# Altium project science-board-25.PrjPcb
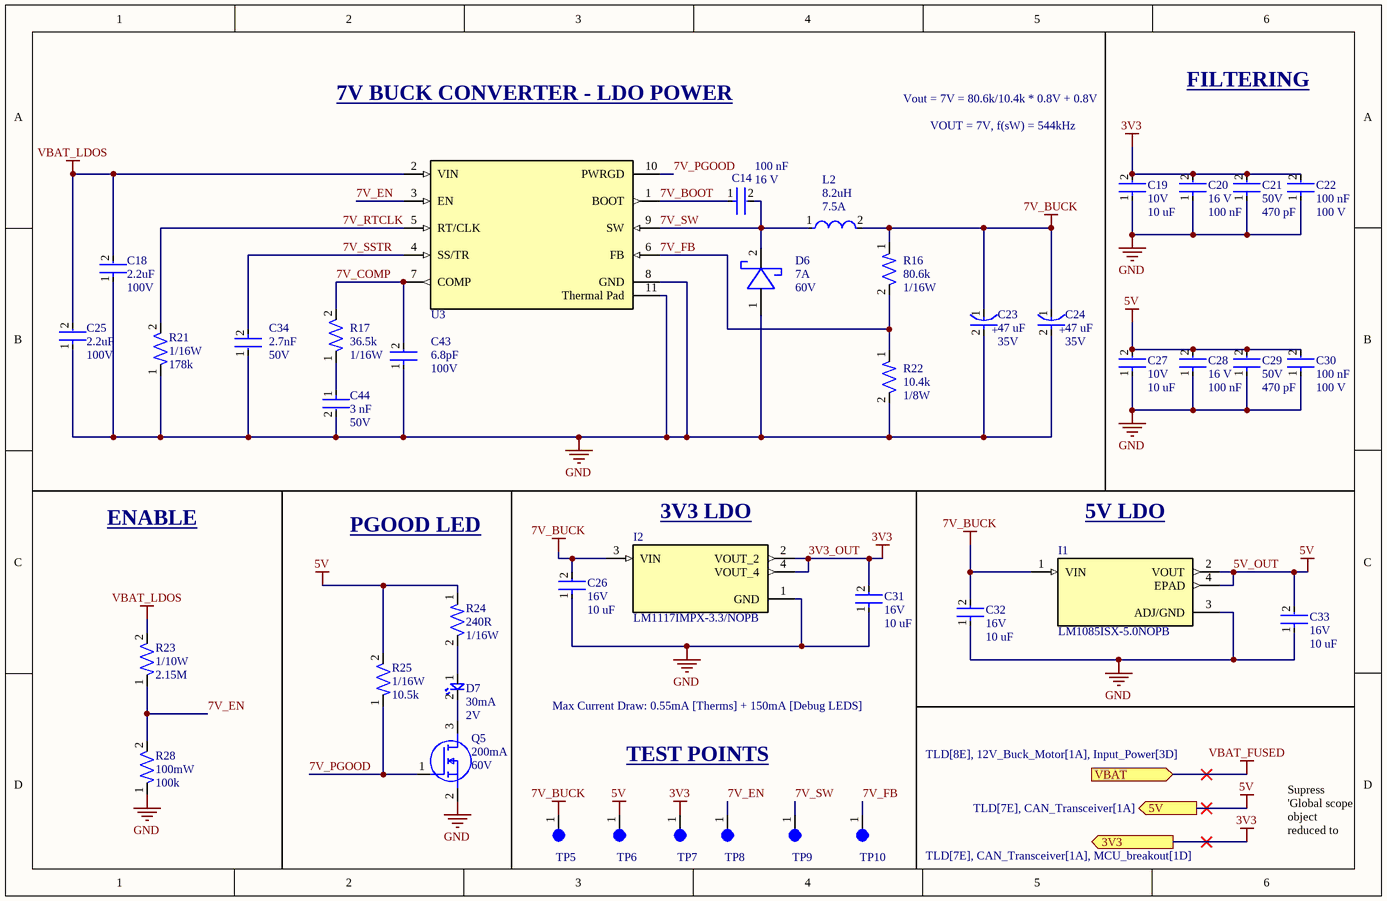
[diagram p0: 7V_5V_3V3_Bucks.SchDoc]
2 sheets, 60 parts. Net scope: flat (ports and power ports of the same name join across sheets).
Board file: science_board_25.PcbDoc
Sheets:
  7V_5V_3V3_Bucks.SchDoc
  Headers.SchDoc

## Sheet 7V_5V_3V3_Bucks.SchDoc
size 259 x 167 mm; SheetNumber: 4; SheetTotal: 7

### Parts
C14  Voltage Rating: 16 V  Capacitance: 100 nF  [CAP-0402]  (hidden comment: CC0402KRX7R7BB104)
C18  Capacitance: 2.2uF  Voltage: 100V  [CAP-1206]  (hidden comment: CC1206KKX7R0BB225)
C19  Voltage: 10V  Capacitance: 10 uF  [CAP-0603]  (hidden comment: CC0603KRX5R6BB106)
C20  Voltage Rating: 16 V  Capacitance: 100 nF  [CAP-0402]  (hidden comment: CC0402KRX7R7BB104)
C21  Voltage: 50V  Capacitance: 470 pF  [CAP-0805]  (hidden comment: CC0805JRNPO9BN471)
C22  Capacitance: 100 nF  Voltage: 100 V  [CAP-0603]  (hidden comment: CC0603KRX7R0BB104)
C23  Capacitance: 47 uF  Voltage: 35V  [CAP-Radial-SMD]  (hidden comment: EEH-ZC1V470P)
C24  Capacitance: 47 uF  Voltage: 35V  [CAP-Radial-SMD]  (hidden comment: EEH-ZC1V470P)
C25  Capacitance: 2.2uF  Voltage: 100V  [CAP-1206]  (hidden comment: CC1206KKX7R0BB225)
C26  Voltage: 16V  Capacitance: 10 uF  [CAP-1210]  (hidden comment: 293D106X9016A2TE3)
C27  Voltage: 10V  Capacitance: 10 uF  [CAP-0603]  (hidden comment: CC0603KRX5R6BB106)
C28  Voltage Rating: 16 V  Capacitance: 100 nF  [CAP-0402]  (hidden comment: CC0402KRX7R7BB104)
C29  Voltage: 50V  Capacitance: 470 pF  [CAP-0805]  (hidden comment: CC0805JRNPO9BN471)
C30  Capacitance: 100 nF  Voltage: 100 V  [CAP-0603]  (hidden comment: CC0603KRX7R0BB104)
C31  Voltage: 16V  Capacitance: 10 uF  [CAP-1210]  (hidden comment: 293D106X9016A2TE3)
C32  Voltage: 16V  Capacitance: 10 uF  [CAP-1210]  (hidden comment: 293D106X9016A2TE3)
C33  Voltage: 16V  Capacitance: 10 uF  [CAP-1210]  (hidden comment: 293D106X9016A2TE3)
C34  Voltage: 50V  Capacitance: 2.7nF  [CAP-0805]  (hidden comment: GRM2165C1H272JA01D)
C43  Voltage: 100V  Capacitance: 6.8pF  [CAP-0603]  (hidden comment: CC0603CRNPO0BN6R8)
C44  Voltage: 50V  Capacitance: 3 nF  [CAP-0603]  (hidden comment: GRM1885C1H302JA01D)
D6  Forward Current: 7A  Reverse Voltage (DC): 60V  [DO-POWERDI5]  (hidden comment: PDS760-13)
D7  Forward Current: 30mA  Forward Voltage: 2V  [LED-0603]  (hidden comment: BL-HKC36G-AV-TRB)
I1  LM1085ISX-5.0NOPB  [IC-TO-263-4]
I2  LM1117IMPX-3.3/NOPB  [IC-SOT-223-4]
L2  Inductance: 8.2uH  Current Rating: 7.5A  [IND25X25CZ]  (hidden comment: IHLP2525CZER8R2M01)
Q5  Continuous Current: 200mA  Voltage: 60V  [IC-SOT23-3]  (hidden comment: T2N7002AK,LM)
R16  Resistance: 80.6k  Power: 1/16W  [RES-0402]  (hidden comment: RC0402FR-0780K6L)
R17  Power: 1/16W  Resistance: 36.5k  [RES-0402]  (hidden comment: RC0402FR-0736K5L)
R21  Power: 1/16W  Resistance: 178k  [RES-0402]  (hidden comment: RTT021783FTH)
R22  Power: 1/8W  Resistance: 10.4k  [RES-0805]  (hidden comment: RT0805BRD0710K4L)
R23  Power: 1/10W  Resistance: 2.15M  [RES-0603]  (hidden comment: RC0603FR-072M15L)
R24  Resistance: 240R  Power: 1/16W  [RES-0402]  (hidden comment: RC0402FR-07240RL)
R25  Power: 1/16W  Resistance: 10.5k  [RES-0402]  (hidden comment: RC0402FR-0710K5L)
R28  Power: 100mW  Resistance: 100k  [RES-0603]  (hidden comment: RC0603FR-07100KL)
TP5  5003  [TEST-POINT-0001]  (value not drawn)
TP6  5003  [TEST-POINT-0001]  (value not drawn)
TP7  5003  [TEST-POINT-0001]  (value not drawn)
TP8  5003  [TEST-POINT-0001]  (value not drawn)
TP9  5003  [TEST-POINT-0001]  (value not drawn)
TP10  5003  [TEST-POINT-0001]  (value not drawn)
U3  TPS54561DPRR  [IC-10WSON]  (value not drawn)

### Ports
3V3 (out, see TLD[7E], CAN_Transceiver[1A], MCU_breakout[1D]), 5V (out, see TLD[7E], CAN_Transceiver[1A]), VBAT (in, see TLD[8E], 12V_Buck_Motor[1A], Input_Power[3D])

### Nets
3V3_OUT: C19.2 C20.2 C21.2 C22.2 C31.2 I2.2(VOUT_2) I2.4(VOUT_4) TP7.1 ; port 3V3  [also labelled 3V3]
5V_OUT: C27.2 C28.2 C29.2 C30.2 C33.2 I1.2(VOUT) I1.4(EPAD) R24.1 R25.2 TP6.1 ; port 5V  [also labelled 5V]
7V_BUCK: C23.1(C) C24.1(C) C26.2 C32.2 I1.1(VIN) I2.3(VIN) L2.2 R16.1 TP5.1
GND: C18.1 C19.1 C20.1 C21.1 C22.1 C23.2(A) C24.2(A) C25.1 C26.1 C27.1 C28.1 C29.1 C30.1 C31.1 C32.1 C33.1 C34.1 C43.1 C44.2 D6.1(CATHODE) I1.3(ADJ/GND) I2.1(GND) Q5.2(S) R21.1 R22.2 R28.1 U3.8(GND) U3.11(Thermal_Pad)
VBAT_FUSED: port VBAT
VBAT_LDOS: C18.2 C25.2 R23.2 U3.2(VIN)
7V_BOOT: C14.1 U3.1(BOOT)
7V_COMP: C43.2 R17.2 U3.7(COMP)
7V_EN: R23.1 R28.2 TP8.1 U3.3(EN)
7V_FB: R16.2 R22.1 TP10.1 U3.6(FB)
7V_PGOOD: Q5.1(G) R25.1 U3.10(PWRGD)
7V_RTCLK: R21.2 U3.5(RT/CLK)
7V_SSTR: C34.2 U3.4(SS/TR)
7V_SW: C14.2 D6.2(ANODE) L2.1 TP9.1 U3.9(SW)
NetC44_1: C44.1 R17.1
NetD7_1: D7.1 R24.2
NetD7_2: D7.2 Q5.3(D)

### Notes on the sheet
- 7V BUCK CONVERTER - LDO POWER
- Vout = 7V = 80.6k/10.4k * 0.8V + 0.8V
- FILTERING
- VOUT = 7V, f(sW) = 544kHz
- (near I2) 3V3 LDO
- (near I1) 5V LDO
- ENABLE
- PGOOD LED
- Max Current Draw: 0.55mA [Therms] + 150mA [Debug LEDS]
- TEST POINTS
- Supress 'Global scope object reduced to local scope'. This is intended.
- (in symbol CAP-47U-0002) +

### Library data of the parts
C14 C20 C28 = CAP-0.1U-0001: CAP CER 0.1UF 16V X7R 0402; ComponentLink2Description: Datasheet; ComponentLink2URL: https://www.yageo.com/upload/media/product/productsearch/datasheet/mlcc/UPY-GPHC_X7R_6.3V-to-250V_24.pdf; Device Class: Ceramic; Size: 0402
C18 C25 = CAP-2.2U-0001: CAP CER 2.2UF 100V X7R 1206; Device Class: Ceramic; Size: 1206; ComponentLink1Description: Datasheet; ComponentLink1URL: https://www.yageo.com/upload/media/product/productsearch/datasheet/mlcc/UPY-GPHC_X7R_6.3V-to-250V_24.pdf
C19 C27 = CAP-10U-0001: CAP CER 10UF 10V X5R 0603; ComponentLink1Description: Datasheet; ComponentLink1URL: https://www.yageo.com/upload/media/product/app/datasheet/mlcc/upy-gphc_x5r_4v-to-50v.pdf; Device Class: Ceramic; Size: 0603
C21 C29 = CAP-470P-0001: CAP CER 470PF 50V C0G/NPO 0805; Device Class: Ceramic; Size: 0805; ComponentLink1Description: Datasheet; ComponentLink1URL: https://www.yageo.com/upload/media/product/productsearch/datasheet/mlcc/UPY-GP_NP0_16V-to-50V_18.pdf
C22 C30 = CAP-100N-0001: CAP CER 0.1UF 100V X7R 0603; Device Class: Ceramic; Size: 0603; ComponentLink1Description: Datasheet; ComponentLink1URL: https://www.yageo.com/upload/media/product/app/datasheet/mlcc/upy-np0x7r_mv_100-to-630v.pdf
C23 C24 = CAP-47U-0002: CAP ALUM HYBRID 47UF 20% 35V SMD; Device Class: Electrolytic; ComponentLink1Description: Datasheet; ComponentLink1URL: https://industrial.panasonic.com/cdbs/www-data/pdf/RDD0000/ABA0000C1234.pdf
C26 C31-C33 = CAP-10U-0003_1: CAP TANT 10UF 10% 16V 1206; Device Class: Tantalum; Size: 1206; ComponentLink1Description: Datasheet; ComponentLink1URL: https://www.lcsc.com/datasheet/lcsc_datasheet_2304140030_Vishay-Intertech-293D106X9016A2TE3_C110038.pdf
C34 = CAP-2.7N-0001: CAP CER 2700PF 50V C0G/NP0 0805; ComponentLink1Description: Datasheet; ComponentLink1URL: https://search.murata.co.jp/Ceramy/image/img/A01X/G101/ENG/GRM2165C1H272JA01-01.pdf; Device Class: Ceramic; Size: 0805
C43 = CAP-6.8P-0001: CAP CER 6.8PF 100V C0G/NPO 0603; Device Class: Ceramic; ComponentLink1Description: Datasheet; ComponentLink1URL: https://www.yageo.com/upload/media/product/productsearch/datasheet/mlcc/UPY-GPHC_X7R_6.3V-to-250V_24.pdf; Size: 0603
C44 = CAP-3N-0001: 3000 pF ±5% 50V Ceramic Capacitor C0G, NP0 0603 (1608 Metric); Device Class: Ceramic; Size: 1210; ComponentLink1Description: Datasheet; ComponentLink1URL: https://mm.digikey.com/Volume0/opasdata/d220001/medias/docus/41/CL32B106KBJNNNE_Spec.pdf
D6 = DIO-SCHOTTKY-0001: DIODE SCHOTTKY 60V 7A POWERDI5; ComponentLink1Description: Datasheet; ComponentLink1URL: https://www.diodes.com/assets/Datasheets/PDS760.pdf
D7 = LED-0001: LED YELLOW CLEAR 0603 SMD; ComponentLink1Description: Datasheet; ComponentLink1URL: https://www.americanbrightled.com/pdffiles/led-components/smt/BL-HKC36G-AV-TRB.pdf
I1 = IC_LDO_5V_0002: IC REG LIN 5V 3A DDPAK/TO263-3; Mfr_Name: Texas Instruments; RefDes: RefDes; Type: Type; ComponentLink1Description: Datasheet; ComponentLink1URL: https://www.ti.com/lit/ds/symlink/lm1085.pdf?HQS=dis-dk-null-digikeymode-dsf-pf-null-wwe&ts=1729859809163&ref_url=https%253A%252F%252Fwww.ti.com%252Fgeneral%252Fdocs%252Fsuppproductinfo.tsp%253FdistId%253D10%2526gotoUrl%253Dhttps%253A%252F%252Fwww.ti.com%252Flit%252Fgpn%252Flm1085
I2 = IC_LDO_3V3_0001: IC REG LIN 3.3V 800MA SOT223-4; ComponentLink1Description: New link; ComponentLink1URL: https://www.ti.com/lit/ds/symlink/lm1117.pdf?HQS=dis-dk-null-digikeymode-dsf-pf-null-wwe&ts=1721700739746
L2 = IND-8.2U-0001: 8.2 µH Shielded Molded Inductor 4 A 68mOhm Max Nonstandard; ComponentLink1Description: Datasheet; ComponentLink1URL: https://products.sumida.com/products/pdf/CDRH104.pdf
Q5 = NMOS-200MA-0001: MOSFET N-CH 60V 200MA SOT23; ComponentLink1Description: Datasheet; ComponentLink1URL: https://toshiba.semicon-storage.com/info/T2N7002AK_datasheet_en_20150401.pdf?did=29712&prodName=T2N7002AK
R16 = RES-80.6k-0001: 80.6 kOhms ±1% 0.063W, 1/16W Chip Resistor 0402 (1005 Metric) Moisture Resistant Thick Film; Tolerance: 1%; Size: 0402; ComponentLink1Description: Datasheet; ComponentLink1URL: https://www.yageo.com/upload/media/product/products/datasheet/rchip/PYu-RC_Group_51_RoHS_L_12.pdf
R17 = RES-36.5k-0001: 36.5 kOhms ±1% 0.063W, 1/16W Chip Resistor 0402 (1005 Metric) Moisture Resistant Thick Film; Parameter 1: *
R21 = RES-178k-0001_1: 62.5mW Thick Film Resistors 50V ±100ppm/℃ ±1% 178kΩ 0402 Chip Resistor - Surface Mount ROHS; Tolerance: 1%; Size: 0402; ComponentLink1Description: Datasheet; ComponentLink1URL: https://www.lcsc.com/datasheet/lcsc_datasheet_2304140030_RALEC-RTT021783FTH_C102842.pdf
R22 = RES-10.4k-0001: 10.4 kOhms ±0.1% 0.125W, 1/8W Chip Resistor 0805 (2012 Metric) Thin Film; Tolerance: 1%; Size: 0402; ComponentLink1Description: Datasheet; ComponentLink1URL: https://www.yageo.com/upload/media/product/products/datasheet/rchip/PYu-RC_Group_51_RoHS_L_12.pdf
R23 = RES-2.15M-0001: RES SMD 2.15M OHM 1% 1/10W 0603; Tolerance: 1%; Size: 0603; ComponentLink1Description: Datasheet; ComponentLink1URL: https://www.yageo.com/upload/media/product/products/datasheet/rchip/PYu-RC_Group_51_RoHS_L_12.pdf
R24 = RES-240-0001: 240R 0.063W 1% 0402 (1005 Metric)  SMD; Tolerance: 1%; Size: 0402; ComponentLink1Description: Datasheet; ComponentLink1URL: https://www.yageo.com/upload/media/product/products/datasheet/rchip/PYu-RC_Group_51_RoHS_L_12.pdf
R25 = RES-10.5k-0001: RES 10.5K OHM 1% 1/16W 0402; Tolerance: 1%; Size: 0402; ComponentLink1Description: Datasheet; ComponentLink1URL: https://www.yageo.com/upload/media/product/products/datasheet/rchip/PYu-RC_Group_51_RoHS_L_12.pdf
R28 = RES-100k-0001: RES SMD 100K OHM 1% 1/10W 0603; Tolerance: 1%; Size: 0603; ComponentLink1Description: Datasheet; ComponentLink1URL: https://www.yageo.com/upload/media/product/products/datasheet/rchip/PYu-RC_Group_51_RoHS_L_12.pdf
TP5-TP10 = TEST-POINT-0001: Oranange PC Test Point, Miniature Phoisphor Bronze Silver Plating Through Hole Mounting Type
U3 = IC-BUCK-0001: IC REG BUCK ADJ 5A 10WSON; ComponentLink1Description: Datasheet; ComponentLink1URL: https://www.ti.com/general/docs/suppproductinfo.tsp?distId=10&gotoUrl=https%3A%2F%2Fwww.ti.com%2Flit%2Fgpn%2Ftps54561

## Sheet Headers.SchDoc
size A; SheetNumber: 6; SheetTotal: 7
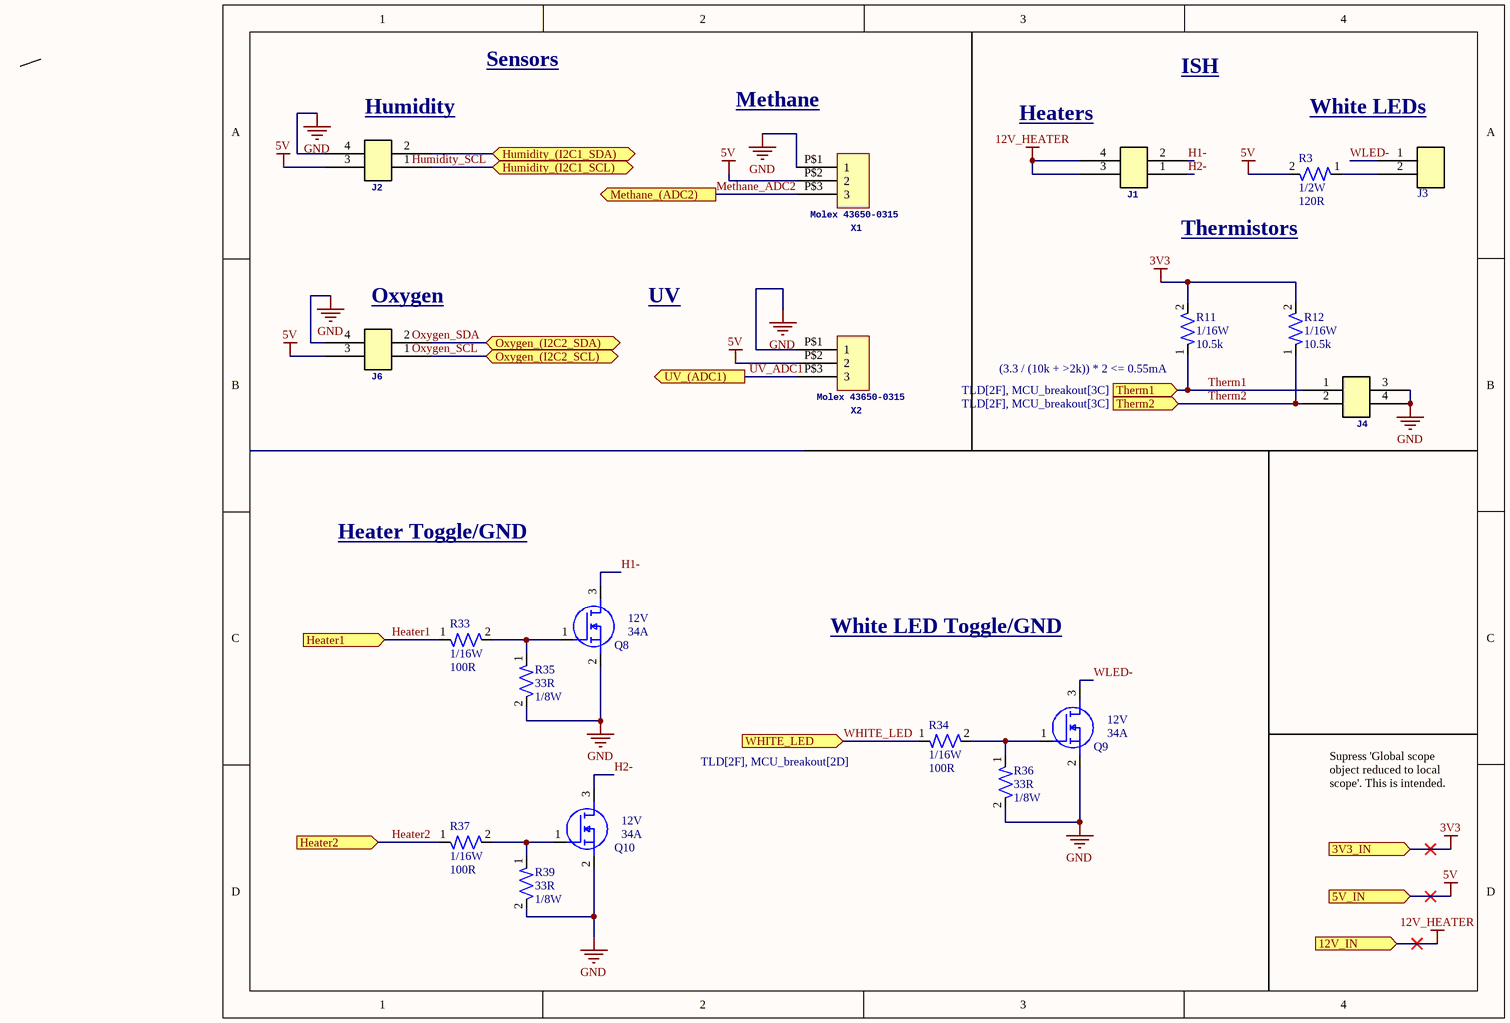
[diagram p1: Headers.SchDoc]

### Parts
J1  Molex 43045-0412  [CONN-4POS-0002]  (value not drawn)
J2  Molex 43045-0412  [CONN-4POS-0002]  (value not drawn)
J3  0430450212  [CONN-2POS-0001]  (value not drawn)
J4  Molex 43045-0412  [CONN-4POS-0002]  (value not drawn)
J6  Molex 43045-0412  [CONN-4POS-0002]  (value not drawn)
Q8  SI4838BDY-T1-GE3  [SOIC8_NARROW_VIS]  (value not drawn)
Q9  SI4838BDY-T1-GE3  [SOIC8_NARROW_VIS]  (value not drawn)
Q10  SI4838BDY-T1-GE3  [SOIC8_NARROW_VIS]  (value not drawn)
R3  Power: 1/2W  Resistance: 120R  [RES-1210]  (hidden comment: RC1210FR-07120RL)
R11  Power: 1/16W  Resistance: 10.5k  [RES-0402]  (hidden comment: RC0402FR-0710K5L)
R12  Power: 1/16W  Resistance: 10.5k  [RES-0402]  (hidden comment: RC0402FR-0710K5L)
R33  Power: 1/16W  Resistance: 100R  [RES-0402]  (hidden comment: RC0402FR-07100RL)
R34  Power: 1/16W  Resistance: 100R  [RES-0402]  (hidden comment: RC0402FR-07100RL)
R35  Resistance: 33R  Power: 1/8W  [RES-0402]  (hidden comment: RC0402FR-7W33RL)
R36  Resistance: 33R  Power: 1/8W  [RES-0402]  (hidden comment: RC0402FR-7W33RL)
R37  Power: 1/16W  Resistance: 100R  [RES-0402]  (hidden comment: RC0402FR-07100RL)
R39  Resistance: 33R  Power: 1/8W  [RES-0402]  (hidden comment: RC0402FR-7W33RL)
X1  Molex 43650-0315  [43650-0315]
X2  Molex 43650-0315  [43650-0315]

### Ports
3V3_IN (in), 5V_IN (in), 12V_IN (in), Heater1 (in, see TLD[3G], MCU_breakout[1C]), Heater2 (in, see TLD[3G], MCU_breakout[1C]), Humidity_(I2C1_SCL) (bidir, see TLD[2G]), Humidity_(I2C1_SDA) (bidir, see TLD[2G]), Methane_(ADC2) (out, see TLD[2G]), Oxygen_(I2C2_SCL) (bidir, see TLD[2F]), Oxygen_(I2C2_SDA) (bidir, see TLD[2F]), Therm1 (in, see TLD[2F], MCU_breakout[3C]), Therm2 (in, see TLD[2F], MCU_breakout[3C]), UV_(ADC1) (out, see TLD[2F]), WHITE_LED (in, see TLD[2F], MCU_breakout[2D])

### Nets
3V3: R11.2 R12.2 ; port 3V3_IN  [project net 3V3_OUT]
5V: J2.3 J6.3 R3.2 X1.P$2(2) X2.P$2(2) ; port 5V_IN  [project net 5V_OUT]
12V_HEATER: J1.3 J1.4 ; port 12V_IN
GND: J2.4 J4.3 J4.4 J6.4 Q8.2(S) Q9.2(S) Q10.2(S) R35.2 R36.2 R39.2 X1.P$1(1) X2.P$1(1)
H1-: J1.2 Q8.3(D)
H2-: J1.1 Q10.3(D)
Heater1: R33.1 ; port Heater1
Heater2: R37.1 ; port Heater2
Methane_ADC2: X1.P$3(3) ; port Methane_(ADC2)
Therm1: J4.1 R11.1 ; port Therm1
Therm2: J4.2 R12.1 ; port Therm2
UV_ADC1: X2.P$3(3) ; port UV_(ADC1)
WHITE_LED: R34.1 ; port WHITE_LED
WLED-: J3.1 Q9.3(D)
NetJ2_1: J2.1 ; port Humidity_(I2C1_SCL)
NetJ2_2: J2.2 ; port Humidity_(I2C1_SDA)
NetJ3_2: J3.2 R3.1
NetJ6_1: J6.1 ; port Oxygen_(I2C2_SCL)
NetJ6_2: J6.2 ; port Oxygen_(I2C2_SDA)
NetQ8_1: Q8.1(G) R33.2 R35.1
NetQ9_1: Q9.1(G) R34.2 R36.1
NetQ10_1: Q10.1(G) R37.2 R39.1

### Notes on the sheet
- Sensors
- ISH
- (near J2) Humidity
- Methane
- (near J1) Heaters
- White LEDs
- Thermistors
- (near J6) Oxygen
- UV
- (near R11) (3.3 / (10k + >2k)) * 2 <= 0.55mA
- Heater Toggle/GND
- White LED Toggle/GND
- Supress 'Global scope object reduced to local scope'. This is intended.
- Labels drawn without touching a wire or pin: Humidity_SCL, Oxygen_SCL, Oxygen_SDA
- (in symbol NMOS-34A-0001) 12V; 34A

### Library data of the parts
J1 J2 J4 J6 = CONN-4POS-0002: CONN HEADER VERT 4POS 3MM; ComponentLink1Description: Datasheet; ComponentLink1URL: https://www.molex.com/content/dam/molex/molex-dot-com/products/automated/en-us/salesdrawingpdf/430/43045/430450412_sd.pdf?inline
J3 = CONN-2POS-0001: CONN HEADER VERT 2POS; ComponentLink1Description: Datasheet; ComponentLink1URL: https://tools.molex.com/pdm_docs/ps/PS-43045.pdf
Q8-Q10 = NMOS-34A-0001: MOSFET N-CH 12 V 34A (Tc) 2.5W (Ta), 5.7W (Tc) Surface Mount 8-SOIC; Mfr_Name: Vishay; RefDes: RefDes; Type: Type
R3 = RES-120-0001: RES 120 OHM 1% 1/2W 1210; Tolerance: 1%; Size: 1210; ComponentLink1Description: Datasheet; ComponentLink1URL: https://www.yageo.com/upload/media/product/products/datasheet/rchip/PYu-RC_Group_51_RoHS_L_12.pdf
R11 R12 = RES-10.5k-0001: RES 10.5K OHM 1% 1/16W 0402; Tolerance: 1%; Size: 0402; ComponentLink1Description: Datasheet; ComponentLink1URL: https://www.yageo.com/upload/media/product/products/datasheet/rchip/PYu-RC_Group_51_RoHS_L_12.pdf
R33 R34 R37 = RES-100-0001: RES 100 OHM 1% 1/16W 0402; Tolerance: 1%; Size: 0402; ComponentLink1Description: Datasheet; ComponentLink1URL: https://www.yageo.com/upload/media/product/products/datasheet/rchip/PYu-RC_Group_51_RoHS_L_12.pdf
R35 R36 R39 = RES-33-0001: RES 33 OHM 1% 1/8W 0402; Tolerance: 1%; Size: 0402; ComponentLink1Description: Datasheet; ComponentLink1URL: https://www.yageo.com/upload/media/product/products/datasheet/rchip/PYu-RC_Group_51_RoHS_L_12.pdf
X1 X2 = Micro-Fit Molex 3 Pin Vertical: GateName_1: G$1; SymbolName_1: HEADER_POS3; DeviceSetName: HEADER_POS3_?; DeviceName: 43650-0315; LibraryName: con-molex-micro-fit-3_0_2; Package: 43650-0315

## Nets that join several sheets
3V3_OUT: 7V_5V_3V3_Bucks (8 pins), Headers (R11.2 R12.2)
5V_OUT: 7V_5V_3V3_Bucks (10 pins), Headers (5 pins)
GND: 7V_5V_3V3_Bucks (28 pins), Headers (12 pins)